# EasyEDA Pro project [EVT_Rev_A]Shock_Measurement.eprj

# Schematic Schematic1
Board Name: Board1; Create Date: 2025-05-25; Page Name: P1; Project Name: [EVT_Rev A]Shock_Measurement; Schematic Name: Schematic1; Update Date: 2025-05-26; Company: 嘉立创EDA; Page Size: A4; Version: V1.0
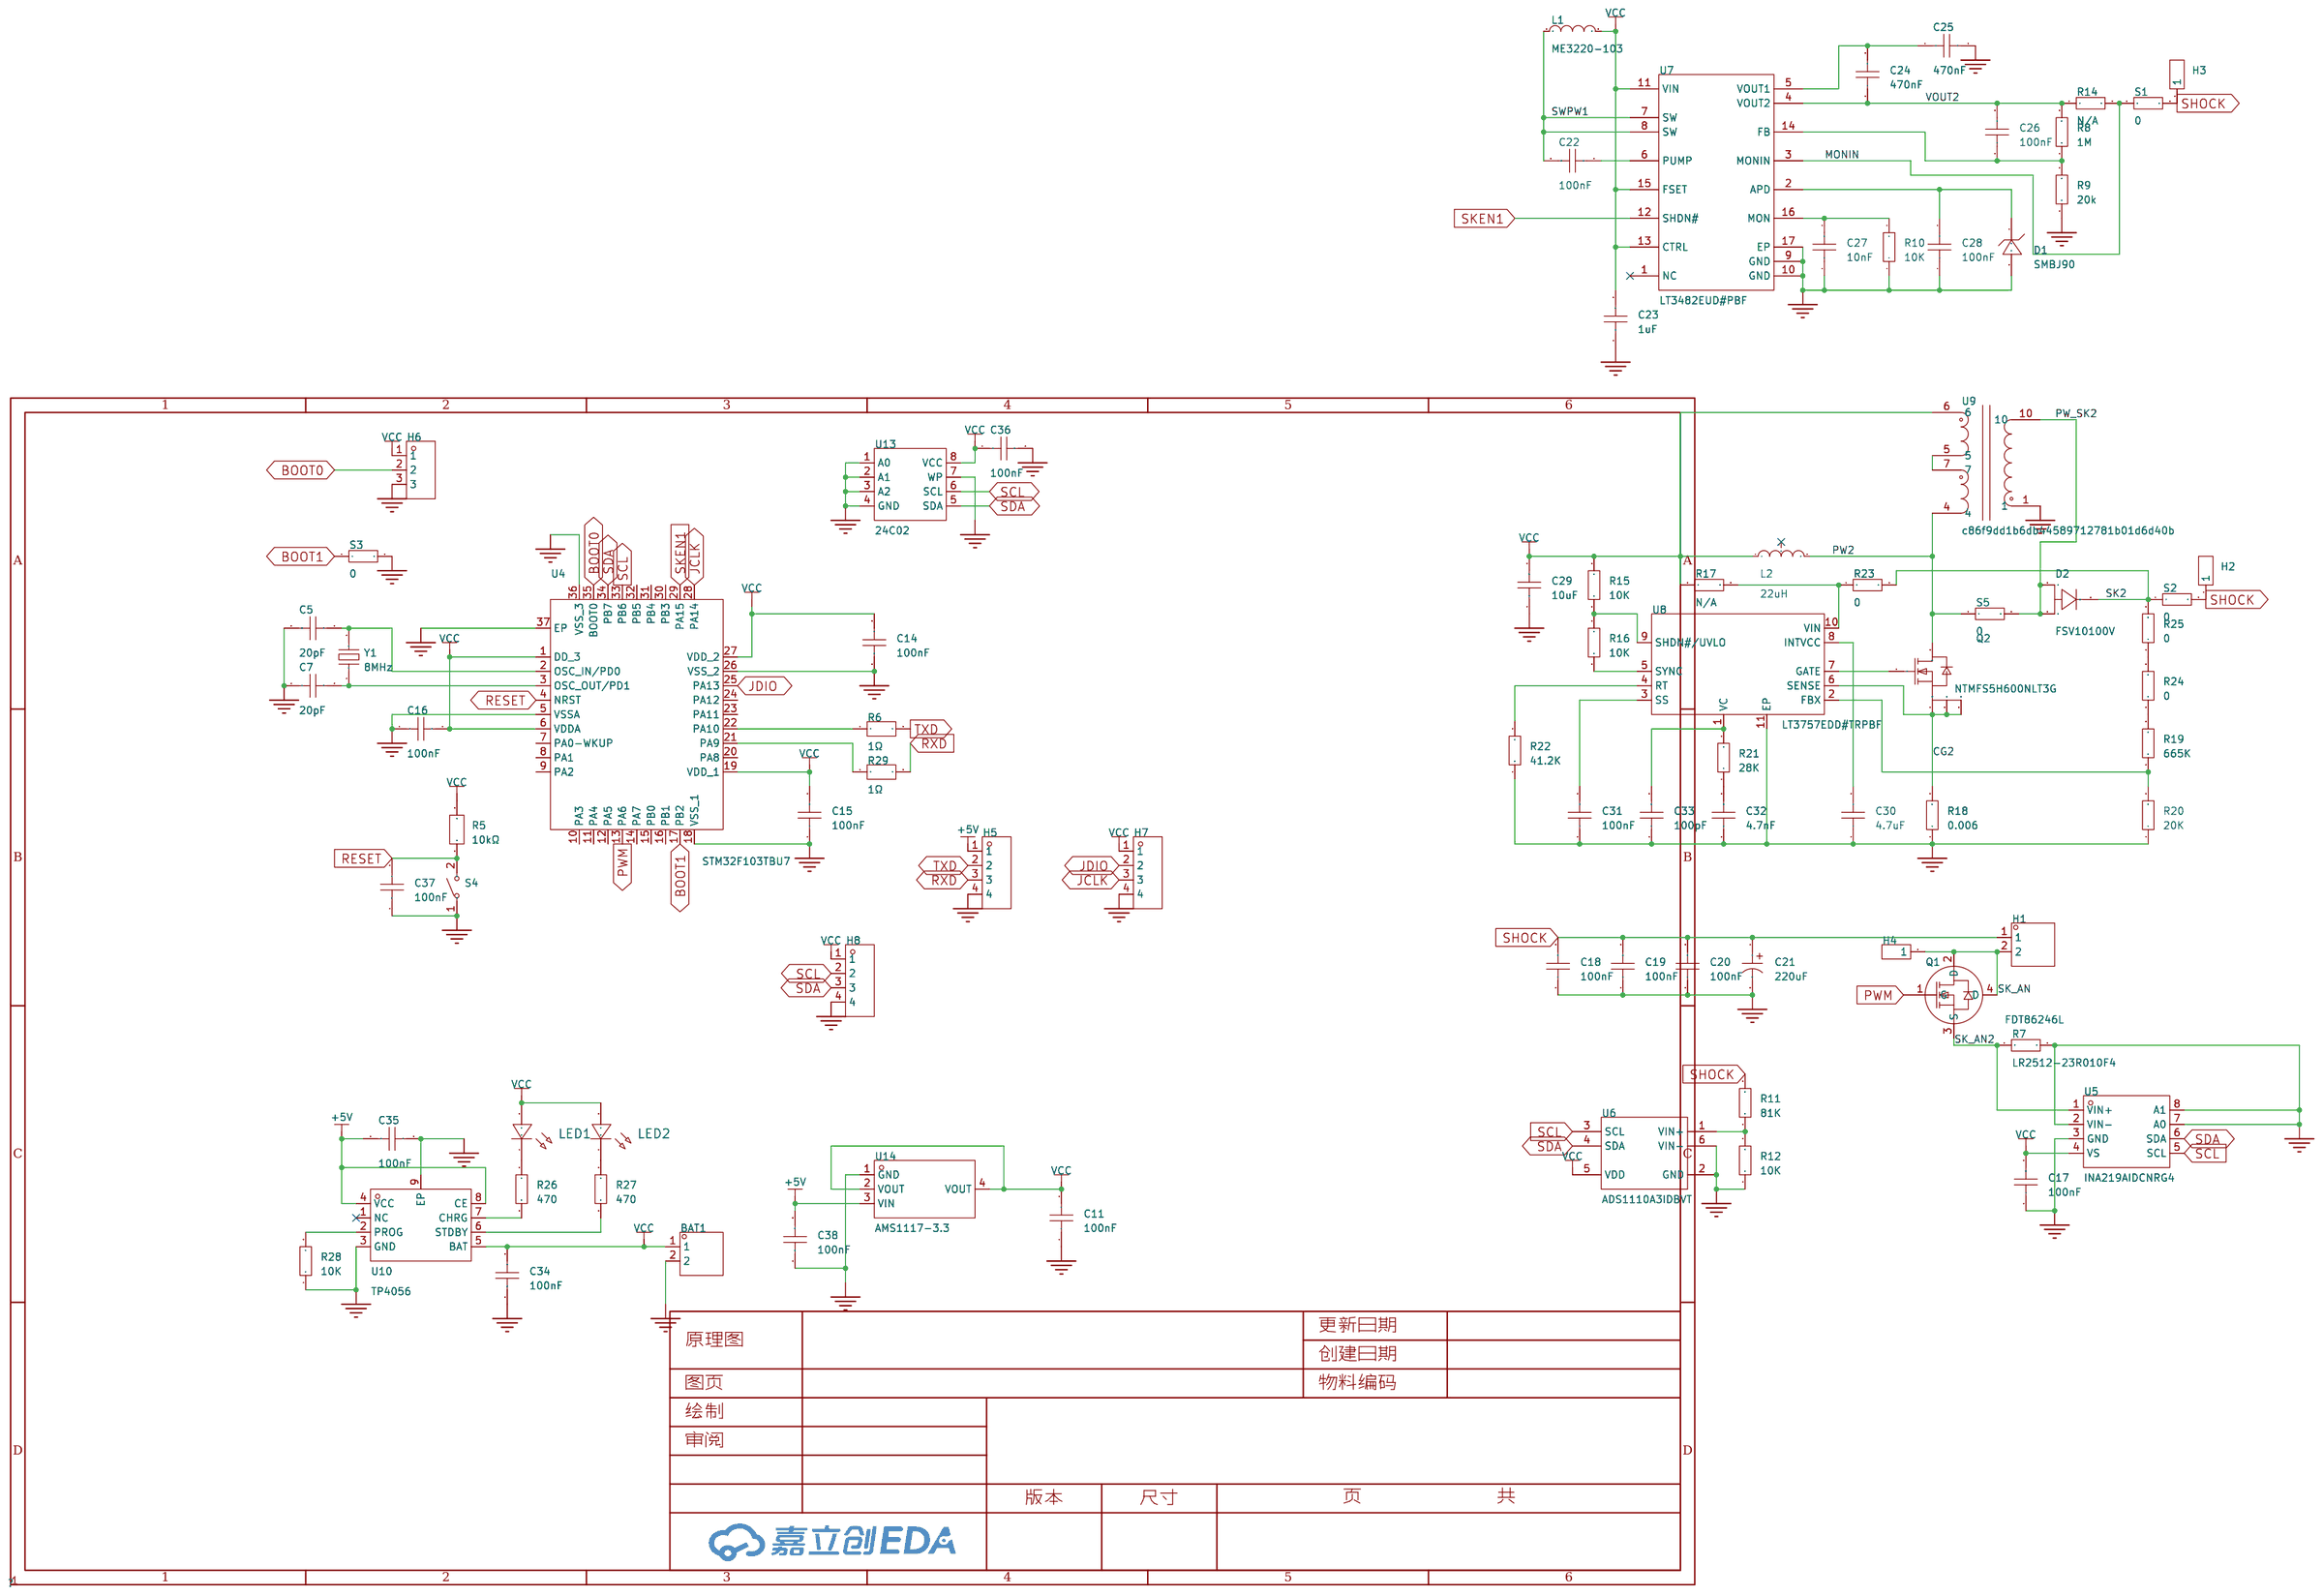
[diagram p0: schematic sheet]

## Parts
BAT1  -  [HDR-TH_2P-P2.54-V-M-1]
C5  20pF  [C0603]
C7  20pF  [C0603]
C11  100nF  [C0603]
C14  100nF  [C0603]
C15  100nF  [C0603]
C16  100nF  [C0603]
C17  100nF  [C0603]
C18  100nF  [C0603]
C19  100nF  [C0805]
C20  100nF  [C1206]
C21  220uF  [CAP-TH_BD8.0-P3.50-D0.6-FD]
C22  100nF  [C0603]
C23  1uF  [C0603]
C24  470nF  [C1206]
C25  470nF  [C1206]
C26  100nF  [C0603]
C27  10nF  [C0603]
C28  100nF  [C0603]
C29  10uF  [C1206]
C30  4.7uF  [C1206]
C31  100nF  [C0603]
C32  4.7nF  [C0603]
C33  100pF  [C0603]
C34  100nF  [C0603]
C35  100nF  [C0603]
C36  100nF  [C0603]
C37  100nF  [C0603]
C38  100nF  [C0603]
D1  SMBJ90  [SMB_L4.6-W3.6-LS5.3-RD]
D2  FSV10100V  [TO-277A_L5.9-W4.4-LS6.5-TR]
H1  -  [HDR-TH_2P-P2.54-V-M-1]
H2  -  [HDR-TH_1P-V-M_XKB_X4611WV-01I-C28D40]
H3  -  [HDR-TH_1P-V-M_XKB_X4611WV-01I-C28D40]
H4  -  [HDR-TH_1P-V-M_XKB_X4611WV-01I-C28D40]
H5  -  [HDR-TH_4P-P2.54-V-M]
H6  -  [HDR-TH_3P-P2.54-V-M]
H7  -  [HDR-TH_4P-P2.54-V-M]
H8  -  [HDR-TH_4P-P2.54-V-M]
L1  ME3220-103  [IND-SMD_L3.2-W2.8]
L2  22uH  [SMD-3_SER2915H-222KL]
LED1  -  [LED_0603]
LED2  -  [LED_0603]
Q1  FDT86246L  [SOT-223-4_L6.5-W3.5-P2.30-LS7.0-BR]
Q2  NTMFS5H600NLT3G  [DFN-5_L4.9-W5.9-P1.27-LS6.2-BL]
R5  10kΩ  [R0603]
R6  1Ω  [R0603]
R7  LR2512-23R010F4  [RES-SMD_L6.4-W3.2]
R8  1M  [R0603]
R9  20k  [R0603]
R10  10K  [R0603]
R11  81K  [R0603]
R12  10K  [R0603]
R14  N/A  [R1206]
R15  10K  [R0603]
R16  10K  [R0603]
R17  N/A  [R0603]
R18  0.006  [R1206]
R19  665K  [R0603]
R20  20K  [R0603]
R21  28K  [R0603]
R22  41.2K  [R0603]
R23  0  [R0603]
R24  0  [R0603]
R25  0  [R0603]
R26  470  [R0603]
R27  470  [R0603]
R28  10K  [R0603]
R29  1Ω  [R0603]
S1  0  [R1206]
S2  0  [R1206]
S3  0  [R0603]
S4  GT-TC024S-H0060-L1  [SW-SMD_L3.0-W2.0-LS3.5]
S5  0  [R1206]
U4  STM32F103TBU7  [UQFN-36_L6.0-W6.0-P0.50-BL-EP3.7]
U5  INA219AIDCNRG4  [SOT-23-8_L2.9-W1.6-P0.65-LS2.8-BR]
U6  ADS1110A3IDBVT  [SOT-23-6_L2.9-W1.6-P0.95-LS2.8-BR]
U7  LT3482EUD#PBF  [QFN-16_L3.0-W3.0-P0.50-BL-EP1.7]
U8  LT3757EDD#TRPBF  [DFN-10_L3.0-W3.0-P0.50-BL-EP-1]
U9  c86f9dd1b6db44589712781b01d6d40b  [DCT15EFD]
U10  TP4056  [ESOP-8_L4.9-W3.9-P1.27-LS6.0-BL-EP-1]
U13  24C02  [SOP-8_L4.9-W3.9-P1.27-LS6.0-BL]
U14  AMS1117-3.3  [SOT-223-3_L6.5-W3.4-P2.30-LS7.0-BR]
Y1  8MHz  [CRYSTAL-SMD_L5.0-W3.2]

## Library data of the parts
BAT1 H1 = HDR-M_2.54_1x2P: Supplier Part: C124375; Supplier Footprint: 插件
C5 C7 = CSA0603C0G200J500JT: 容值:20pF;精度:±5%;额定电压:50V;材质(温度系数):C0G;; LCSC Part Name: 20pF ±5% 50V; Supplier Part: C18220910; Manufacturer: HRE(芯声); Supplier Footprint: 0603; JLCPCB Part Class: 扩展库; Datasheet: https://atta.szlcsc.com/upload/public/pdf/source/20220805/DFFB7DC11B0ABF32BF494A73A541956B.pdf; Supplier: LCSC; Tolerance: ±5%; Voltage Rated: 50V; Temperature Coefficient: C0G
C11 C36 C38 = 0201X104K160NT: 容值:100nF;精度:±10%;额定电压:16V;材质(温度系数):X5R;; LCSC Part Name: 100nF ±10% 16V; Supplier Part: C2846674; Manufacturer: FH(风华); Supplier Footprint: 0201; JLCPCB Part Class: 扩展库; Datasheet: https://atta.szlcsc.com/upload/public/pdf/source/20220211/3FDF6092789FC56E23A16E03DC7301F9.pdf; Supplier: LCSC; Tolerance: ±10%; Voltage Rated: 16V; Temperature Coefficient: X5R
C14-C18 C22 C23 C26-C28 C31-C35 C37 = CAP_0603: Supplier Footprint: 0603
C19 = CAP_0805: Supplier Footprint: 0805
C20 C24 C25 C29 C30 = CAP_1206: Supplier Footprint: 1206
C21 = PA35V220M8x8: LCSC Part Name: 220uF ±20% 35V; Supplier Part: C46550431; Manufacturer: 捷而瑞; Supplier Footprint: 插件,D8xL8mm; JLCPCB Part Class: 扩展库; Datasheet: https://atta.szlcsc.com/upload/public/pdf/source/20250307/831193F737CAF6D75AC25F14E955F0EC.pdf; Supplier: LCSC; Tolerance: ±20%; Voltage Rating: 35V; Ripple Current: 2.9A@100Hz; Equivalent Series Resistance(ESR): 28mΩ@100kHz; Diameter: 8mm; Height - Seated (Max): 8mm; Lifetime: 2000hrs@105℃; Operating Temperature: -55℃~+105℃
D1 = SMBJ24CD-M3/I: Supplier Part: C335775; Manufacturer: VISHAY(威世); Supplier Footprint: SMBJ; Datasheet: https://atta.szlcsc.com/upload/public/pdf/source/20181122/C335775_149570DB14F3A9C7607A2247C4D338E7.pdf; Supplier: LCSC; polarity: 双向; Reverse Stand-Off Voltage (Vrwm): 24V; Maximum Clamping Voltage: 38.4V; Peak Pulse Current (Ipp)@10/1000us: 15.6A; Peak Pulse Power Dissipation (Ppp)@10/1000us: 600W; Breakdown Voltage: 27.1V; Type: TVS
D2 = FSV10100V: LCSC Part Name: 电压:100V 电流:10A; Supplier Part: C719813; Manufacturer: onsemi(安森美); Supplier Footprint: TO-277-3; JLCPCB Part Class: 扩展库; Datasheet: https://atta.szlcsc.com/upload/public/pdf/source/20200807/C719813_CB8FE0C48E9E111741723536464B86A6.pdf; Supplier: LCSC; Diode Configuration: 独立式; Forward Voltage (Vf@If): 625mV@10A; Reverse Voltage (Vr): 100V; Average Rectified Current (Io): 10A; Reverse Leakage Current (Ir): 16.5uA@100V
H2-H4 = HDR-M_2.54_1x1P: Supplier Part: C81276; Supplier Footprint: 插件; JLCPCB Part Class: Extended Part
H5 H7 H8 = HDR-M_2.54_1x4P: Supplier Part: C492403; Supplier Footprint: 插件
H6 = HDR-M_2.54_1x3P: Supplier Part: C2937625; Supplier Footprint: 插件
L1 = ME3220-222MLC: Supplier Part: C19276061; Manufacturer: Coilcraft(线艺); Supplier Footprint: SMD,3.2x2.8mm; JLCPCB Part Class: 扩展库; Supplier: LCSC
L2 = SER2918H-223KL: LCSC Part Name: 22uH ±10% 12A; Supplier Part: C17398237; Manufacturer: Coilcraft(线艺); Supplier Footprint: SMD-3P,27.9x19.8mm; JLCPCB Part Class: 扩展库; Datasheet: https://atta.szlcsc.com/upload/public/pdf/source/20250106/1CF0FC8358061C67E32BA823C2633CFC.pdf; Supplier: LCSC; Tolerance: ±10%; Current Rating: 20A; Current - Saturation(Isat): 12A; DC Resistance(DCR): 2.86mΩ; Ratings: AEC-Q200
LED1 LED2 = LED_0603-R: Supplier Footprint: 0603
Q1 = FDT86246L: 类型:1个N沟道;漏源电压(Vdss):150V;连续漏极电流(Id):2A;导通电阻(RDS(on)@Vgs,Id):228mΩ@10V,2A;功率(Pd):2.2W;阈值电压(Vgs(th)@Id):2.5V@250uA;; LCSC Part Name: 1个N沟道 耐压:150V 电流:2A; Supplier Part: C894836; Manufacturer: onsemi(安森美); Supplier Footprint: SOT-223; JLCPCB Part Class: 扩展库; Datasheet: https://atta.szlcsc.com/upload/public/pdf/source/20210810/FC0B0CAF79AABB1D000473A422D4F683.pdf; Supplier: LCSC; Type: 1个N沟道; Drain Source Voltage (Vdss): 150V; Continuous Drain Current (Id): 2A; Drain Source On Resistance (RDS(on)@Vgs,Id): 228mΩ@10V,2A; Power Dissipation (Pd): 2.2W; Gate Threshold Voltage (Vgs(th)@Id): 2.5V@250uA; Total Gate Charge (Qg@Vgs): 6.3nC@10V; Input Capacitance (Ciss@Vds): 335pF@75V; Reverse Transfer Capacitance (Crss@Vds): 5pF@75V; Operating Temperature: -55℃~+150℃
Q2 = NTMFS5H600NLT3G: LCSC Part Name: N沟道 耐压:60V 电流:250A; Supplier Part: C893888; Manufacturer: onsemi(安森美); Supplier Footprint: DFN-5(5.9x4.9); JLCPCB Part Class: 扩展库; Datasheet: https://atta.szlcsc.com/upload/public/pdf/source/20221020/5F8A0561D4924581173CCC558E049BA7.pdf; Supplier: LCSC; Type: N沟道; Drain Source Voltage (Vdss): 60V; Continuous Drain Current (Id): 250A; Power Dissipation (Pd): 160W; Drain Source On Resistance (RDS(on)@Vgs,Id): 1.1mΩ@10V,50A; Gate Threshold Voltage (Vgs(th)@Id): 2V@250uA; Total Gate Charge (Qg@Vgs): 40nC@4.5V; Input Capacitance (Ciss@Vds): 6.68nF@30V; Reverse Transfer Capacitance (Crss@Vds): 30pF@30V; Operating Temperature: -55℃~+150℃@(Tj)
R5 = RCA0310KJLF: 阻值:10kΩ;精度:±5%;功率:100mW;; LCSC Part Name: 10kΩ ±5% 100mW; Supplier Part: C22369937; Manufacturer: HKR(香港电阻); Supplier Footprint: 0603; JLCPCB Part Class: 扩展库; Datasheet: https://atta.szlcsc.com/upload/public/pdf/source/20240327/626E23E3B2A799D2C85303DE2C37BB2A.pdf; Supplier: LCSC; Tolerance: ±5%; Power(Watts): 100mW
R6 R29 = FRC0603J1R0 TS: 电阻类型:厚膜电阻;阻值:1Ω;精度:±5%;功率:100mW;最大工作电压:75V;温度系数:±200ppm/℃;; LCSC Part Name: 1Ω ±5% 100mW 厚膜电阻; Supplier Part: C2907116; Manufacturer: FOJAN(富捷); Supplier Footprint: 0603; JLCPCB Part Class: 扩展库; Datasheet: https://atta.szlcsc.com/upload/public/pdf/source/20211221/925EC7D7225764EE0046F22065062C87.pdf; Supplier: LCSC; Type: 厚膜电阻; Tolerance: ±5%; Power(Watts): 100mW; Overload Voltage (Max): 75V; Temperature Coefficient: ±200ppm/℃; Operating Temperature Range: -55℃~+155℃
R7 = LR2512-23R010F4: LCSC Part Name: LR2512-23R010F4 合金电阻; Supplier Part: C323803; Manufacturer: RALEC(旺诠); Supplier Footprint: 2512; Datasheet: https://atta.szlcsc.com/upload/public/pdf/source/20181106/C323808_B7090B4A64E6BD0A15998A838DE41D20.pdf; Supplier: LCSC
R8-R12 R15-R17 R19-R28 S3 = Res_0603: Supplier Footprint: 0603
R14 S1 S2 S5 = Res_1218: Supplier Footprint: 1218
R18 = Res_1206: Supplier Footprint: 1206
S4 = GT-TC024S-H0060-L1: 作用力:1.6N;机械寿命:10万次;; LCSC Part Name: 3x2x0.6轻触开关 160gf; Supplier Part: C963197; Manufacturer: G-Switch(品赞); Supplier Footprint: SMD,2x3mm; JLCPCB Part Class: 扩展库; Datasheet: https://atta.szlcsc.com/upload/public/pdf/source/20240820/65D40FDEDF69E37241261E1875AECD00.pdf; Supplier: LCSC; Operating Force: 1.6N; Mechanical Life: 10万次
U4 = STM32F103TBU7: LCSC Part Name: 主流增强型ARM Cortex-M3 MCU，具有128 KB Flash、72 MHz CPU、电机控制、USB和CAN; Supplier Part: C1339326; Manufacturer: ST(意法半导体); Supplier Footprint: UQFN-36-EP(6x6); JLCPCB Part Class: 扩展库; Datasheet: https://atta.szlcsc.com/upload/public/pdf/source/20191108/C446030_27D91C05707EDD0145409FE106B48E64.pdf; Supplier: LCSC; CPU Core: ARM-M3; CPU Maximum Speed: 72MHz; Program Storage Size: 128KB; Program Memory Type: FLASH; Number of I/O: 26; ADC (Bit): 12bit; Low Voltage Detection Threshold: 2V~3.6V
U5 = INA219AIDCNRG4: Supplier Part: C2155693; Manufacturer: TI(德州仪器); Supplier Footprint: SOT-23-8; JLCPCB Part Class: 扩展库; Supplier: LCSC
U6 = ADS1110A3IDBVT: Supplier Part: C94791; Manufacturer: TI(德州仪器); Supplier Footprint: SOT-23-6; Datasheet: https://www.ti.com/cn/lit/gpn/ads1110; Supplier: LCSC; Interface: I2C; differential input: 是; number of channels: 1; Supply Voltage: 2.7V~5.5V; Integral nonlinearity: ±0.01%; sampling frequency: 240Hz; resolution: 16; Operating Temperature: -40℃~+85℃
U7 = LT3482EUD#PBF: LCSC Part Name: 具 APD 电流监视器的 90V 升压型 DC/DC 转换器; Supplier Part: C117167; Manufacturer: ADI(亚德诺); Supplier Footprint: QFN-16-EP(3x3); JLCPCB Part Class: 扩展库; Datasheet: https://atta.szlcsc.com/upload/public/pdf/source/20170712/C117167_1499832323072814351.pdf; Supplier: LCSC; Function: 升压型; Output Type: 可调; Input Voltage: 2.5V~16V; Output Voltage: 5V~90V; Output Current: 280mA; Switching Frequency: 1.1MHz; Operating Temperature: -40℃~+85℃@(TA); Synchronous Rectification: 否; Number of Outputs: 1; Topology: 升压式; Switch tube (built-in/external): 内置
U8 = LT3757EDD#TRPBF: 功能类型:升压型;工作电压:2.9V~40V;输出电流:-;; LCSC Part Name: 升压、反激式、SEPIC 和负输出控制器; Supplier Part: C2658010; Manufacturer: ADI(亚德诺); Supplier Footprint: DFN-10-EP(3x3); JLCPCB Part Class: 扩展库; Datasheet: https://atta.szlcsc.com/upload/public/pdf/source/20170712/C117410_1499832417387814593.pdf; Supplier: LCSC; Function: 升压型; Input Voltage: 2.9V~40V; Switching Frequency: 1MHz; Operating Temperature: -40℃~+125℃@(TJ); Number of Outputs: 1; Topology: SEPIC；升压式；反激式；反相式; Switch tube (built-in/external): 外置
U9 = DCT15EFD
U10 = TP4056_C17702041: LCSC Part Name: TP4056 电池管理 停产; Supplier Part: C17702041; Manufacturer: HXY MOSFET(华轩阳电子); Supplier Footprint: ESOP-8; JLCPCB Part Class: 扩展库; Datasheet: https://atta.szlcsc.com/upload/public/pdf/source/20230912/2EE332A4C24CC2A2ED62D53FAF413673.pdf; Supplier: LCSC; Supply Voltage: 4.5V~8V; Maximum Charge Current: 1.2A; Type of Battery: 锂离子; Number of Cells: 1
U13 = 24C02: 24C02是电可擦除PROM，采用256x8-bit的组织架构，具有页写能力，每页为8字节。支持I2C总线传输协议，工作电压范围1.8V~5.5V，擦写寿命100万次，数据保持时间100年。; LCSC Part Name: 24C02串行I2C总线EEPROM 停产; Supplier Part: C2984961; Manufacturer: HX(恒佳兴); Supplier Footprint: SOP-8; Datasheet: https://atta.szlcsc.com/upload/public/pdf/source/20220328/EEDD5B560A30EF54D50A97B6296179D0.pdf; Supplier: LCSC
U14 = AMS1117-3.3_C6186: 输出类型:固定;最大输入电压:-;输出电压:3.3V;最大输出电流:1A;电源纹波抑制比(PSRR):72dB@(120Hz);输出极性:正极;; LCSC Part Name: 输出3.3V 1A; Supplier Part: C6186; Manufacturer: AMS; Supplier Footprint: SOT-223; JLCPCB Part Class: 基础库; Datasheet: https://atta.szlcsc.com/upload/public/pdf/source/20180727/C6186_7A095716F0823C02F1997A905E26C086.pdf; Supplier: LCSC; Output Type: 固定; Output Voltage: 3.3V; MAX Output Current: 1A; Power Supply Rejection Ratio (PSRR): 72dB@(120Hz); Dropout Voltage: 1.3V@(800mA); Output Polarity: 正极; Number of Outputs: 1
Y1 = S50328M20PF10PPM2P: 频率:8MHz;外接负载电容:20pF;频率稳定度(全温):±30ppm;; LCSC Part Name: 8MHz 20pF; Supplier Part: C7473032; Manufacturer: SST(索斯特); Supplier Footprint: SMD5032-2P; JLCPCB Part Class: 扩展库; Supplier: LCSC; External load capacitor: 20pF; Frequency Stability(Full temperature range): ±30ppm; Operating Temperature: -40℃~+85℃

## Nets
+5V: C35.1 C38.2 H5.1 U10.4(VCC) U10.8(CE) U14.3(VIN)
GND: BAT1.2 C5.1 C7.1 C11.1 C14.1 C15.1 C16.1 C17.1 C18.1 C19.1 C20.1 C21.2 C23.1 C25.2 C27.1 C28.1 C29.1 C30.1 C31.1 C32.1 C33.1 C34.1 C35.2 C36.2 C37.1 C38.1 D1.2(A) H5.4 H6.3 H7.4 H8.4 R7.2 R9.1 R10.1 R12.1 R18.1 R20.1 R22.1 R28.1 S3.2 S4.1 U4.5(VSSA) U4.18(VSS_1) U4.26(VSS_2) U4.36(VSS_3) U4.37(EP) U5.2(VIN-) U5.3(GND) U5.7(A0) U5.8(A1) U6.2(GND) U6.6(VIN-) U7.9(GND) U7.10(GND) U7.17(EP) U8.11(EP) U9.1 U10.3(GND) U10.9(EP) U13.1(A0) U13.2(A1) U13.3(A2) U13.4(GND) U13.7(WP) U14.1(GND)
VCC: BAT1.1 C11.2 C14.2 C15.2 C16.2 C17.2 C23.2 C29.2 C34.2 C36.1 H6.1 H7.1 H8.1 L1.2 L2.1 LED1.2(A) LED2.2(A) R5.2 R15.2 R17.1 U4.1(DD_3) U4.6(VDDA) U4.19(VDD_1) U4.27(VDD_2) U5.4(VS) U6.5(VDD) U7.11(VIN) U7.13(CTRL) U7.15(FSET) U9.6 U10.5(BAT) U13.8(VCC) U14.2(VOUT) U14.4(VOUT)
BOOT0: H6.2 U4.35(BOOT0)
BOOT1: S3.1 U4.17(PB2)
CG2: Q2.1(S) Q2.2(S) Q2.3(S) R18.2 U8.6(SENSE)
JCLK: H7.3 U4.28(PA14)
JDIO: H7.2 U4.25(PA13)
MONIN: R14.2 S1.1 U7.3(MONIN)
PW2: L2.2 Q2.5(D) S5.1 U9.4
PW_SK2: D2.1 D2.2 S5.2 U9.10
PWM: Q1.1(G) U4.13(PA6)
RESET: C37.2 R5.1 S4.2 U4.4(NRST)
RXD: H5.3 R29.2
SCL: H8.2 U4.33(PB6) U5.5(SCL) U6.3(SCL) U13.6(SCL)
SDA: H8.3 U4.34(PB7) U5.6(SDA) U6.4(SDA) U13.5(SDA)
SHOCK: C18.2 C19.2 C20.2 C21.1 H1.1 H2.1 H3.1 R11.2 S1.2 S2.2
SK2: D2.3 R23.2 R25.2 S2.1
SK_AN: H1.2 H4.1 Q1.2(D) Q1.4(D)
SK_AN2: Q1.3(S) R7.1 U5.1(VIN+)
SKEN1: U4.29(PA15) U7.12(SHDN#)
SWPW1: C22.2 L1.1 U7.7(SW) U7.8(SW)
TXD: H5.2 R6.2
VOUT2: C24.1 C26.2 R8.2 R14.1 U7.4(VOUT2)
$1N2976: C5.2 U4.2(OSC_IN/PD0) Y1.2
$1N2977: C7.2 U4.3(OSC_OUT/PD1) Y1.1
$1N6546: C22.1 U7.6(PUMP)
$1N6755: C24.2 C25.1 U7.5(VOUT1)
$1N6889: C26.1 R8.1 R9.2 U7.14(FB)
$1N7063: C27.2 R10.2 U7.16(MON)
$1N7288: C28.2 D1.1(K) U7.2(APD)
$1N7411: R11.1 R12.2 U6.1(VIN+)
$1N8900: R15.1 R16.2 U8.9(SHDN#/UVLO)
$1N8946: R16.1 U8.5(SYNC)
$1N9017: R17.2 R23.1 U8.10(VIN)
$1N9213: Q2.4(G) U8.7(GATE)
$1N9419: R19.1 R20.2 U8.2(FBX)
$1N9497: C30.2 U8.8(INTVCC)
$1N9569: C31.2 U8.3(SS)
$1N9658: C33.2 R21.2 U8.1(VC)
$1N9684: C32.2 R21.1
$1N9747: R22.2 U8.4(RT)
$1N9911: U9.5 U9.7
$1N10070: R19.2 R24.1
$1N10096: R24.2 R25.1
$1N11853: LED1.1(C) R26.2
$1N11879: LED2.1(C) R27.2
$1N11907: R26.1 U10.7(CHRG)
$1N11914: R27.1 U10.6(STDBY)
$1N11976: R28.2 U10.2(PROG)
$1N12461: R29.1 U4.21(PA9)
$1N12467: R6.1 U4.22(PA10)

Not connected (* = marked no-connect by the designer): L2 3*; U4 7(PA0-WKUP) 8(PA1) 9(PA2) 10(PA3) 11(PA4) 12(PA5) 14(PA7) 15(PB0) 16(PB1) 20(PA8) 23(PA11) 24(PA12) 30(PB3) 31(PB4) 32(PB5); U7 1(NC)*; U10 1(NC)*

# Board PCB1
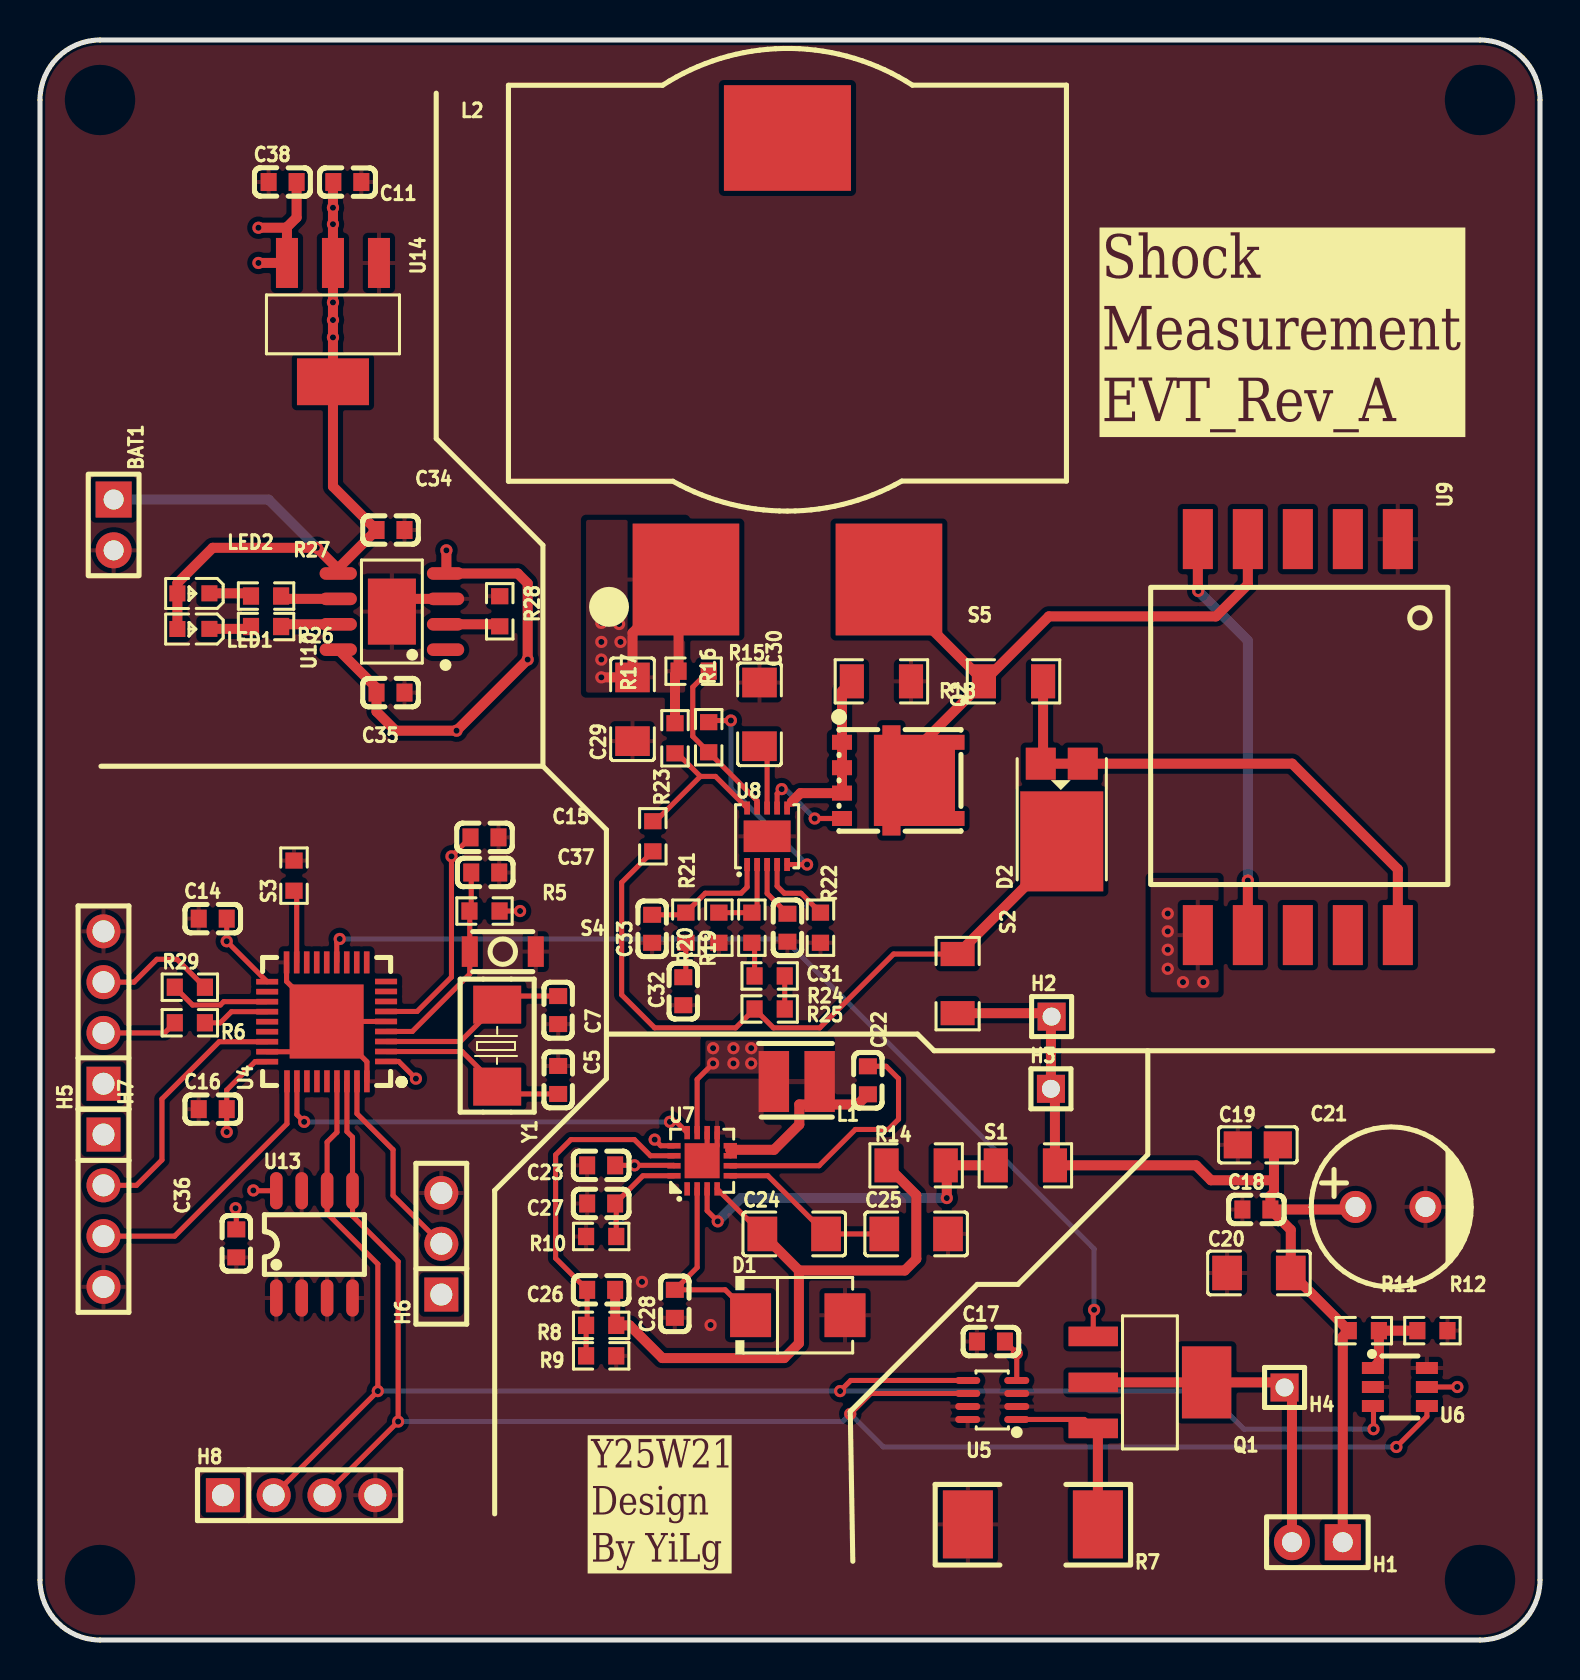
[diagram p1: board, top side]
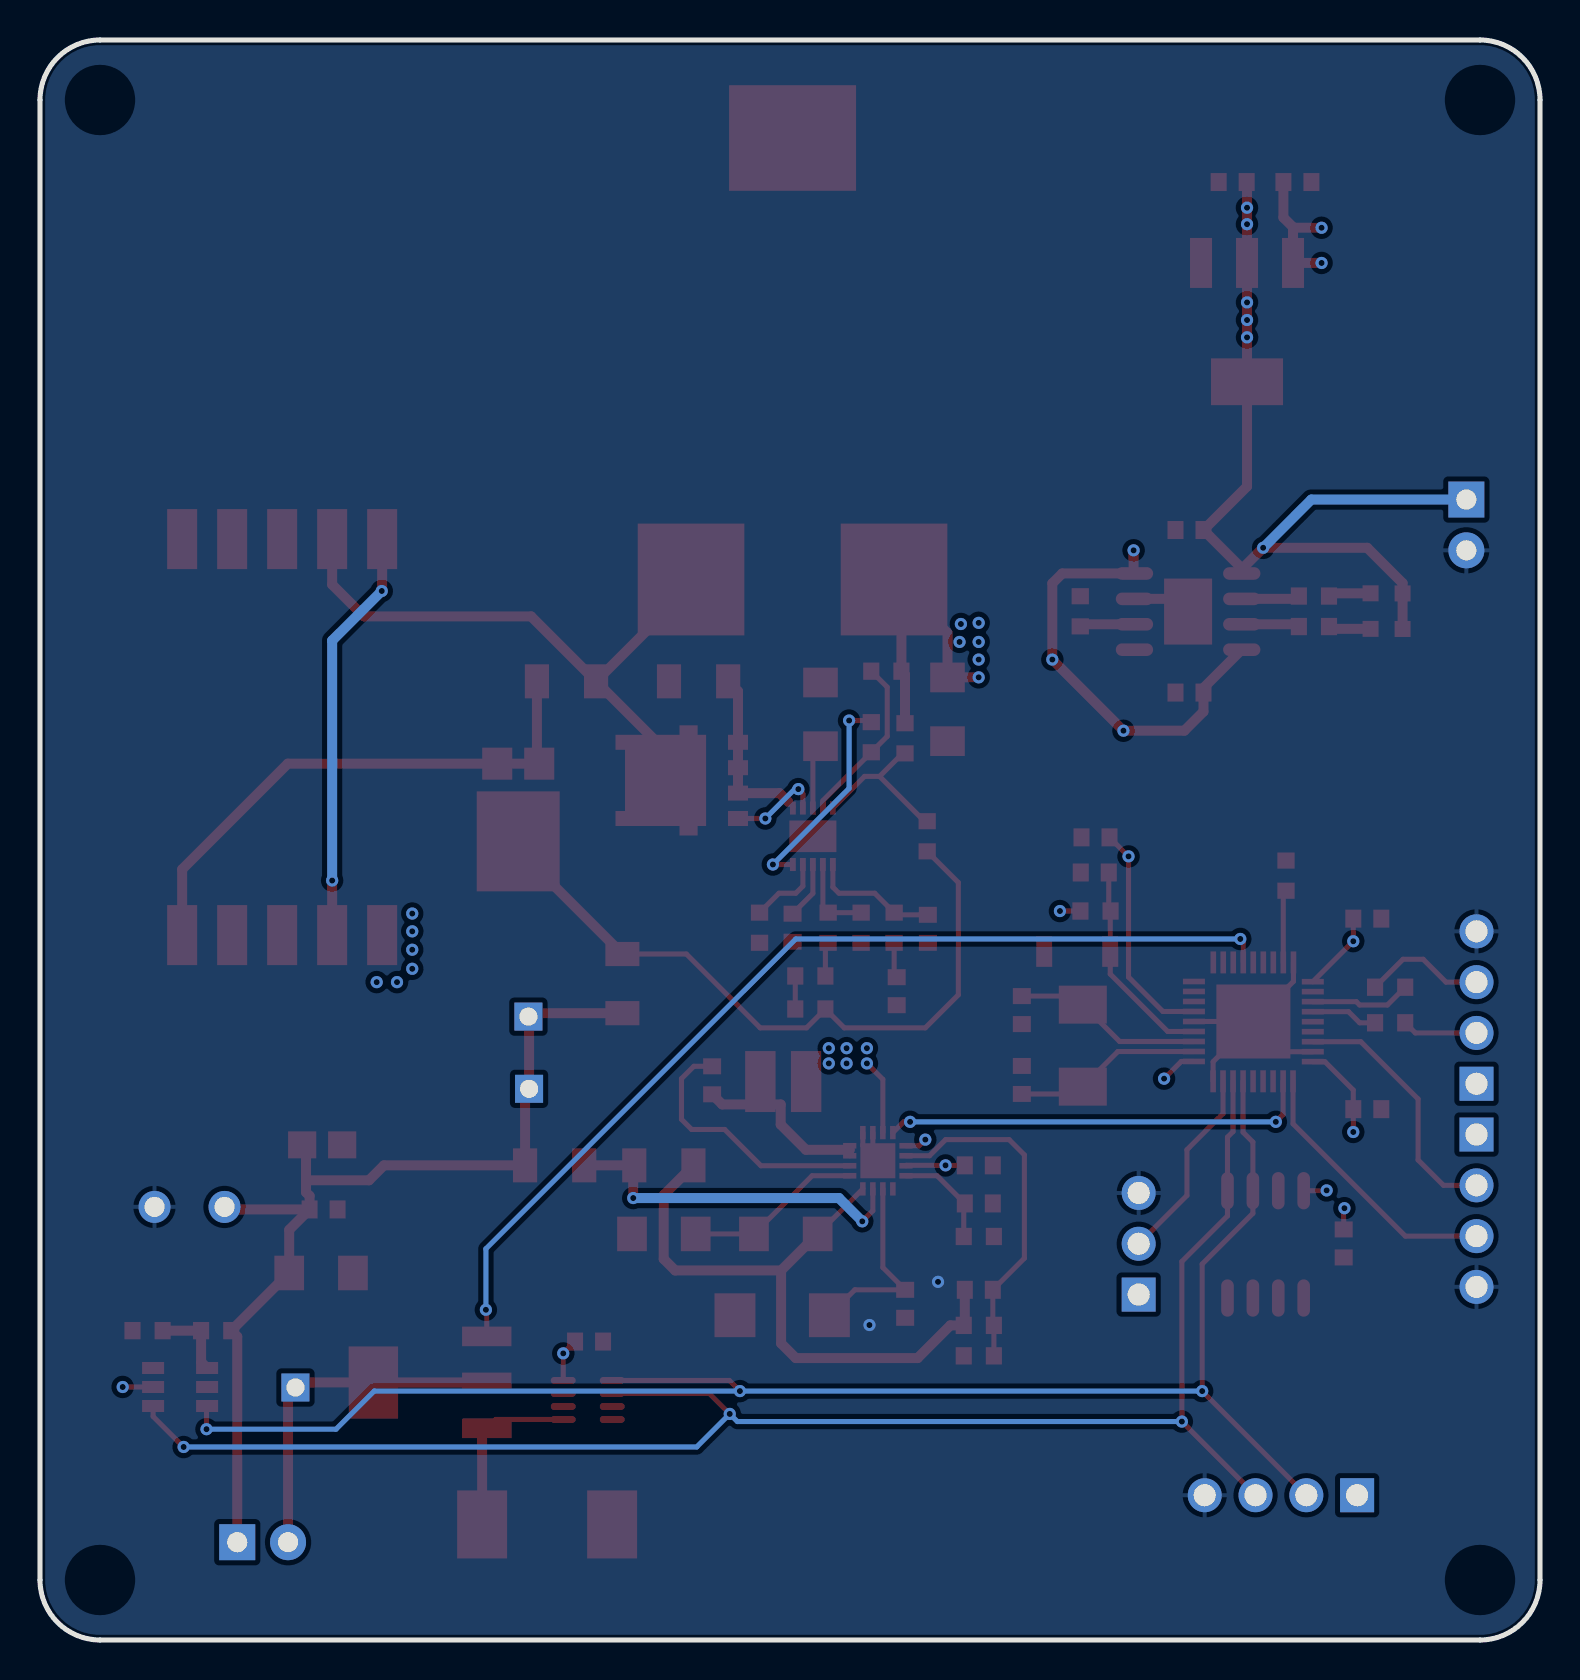
[diagram p2: board, bottom side, seen from below]

Outline 75 x 80 mm; copper layers: Top Layer, Inner1, Inner2, Bottom Layer. Coordinates in mm from the lower left corner of the outline.
Outline path: 0,77 arc(0.88,79.12) 3,80 72,80 arc(74.12,79.12) 75,77 75,3 arc(74.12,0.88) 72,0 3,0 arc(0.88,0.88) 0,3 0,77
Stack: Top Layer 0.035mm 外层铜厚1oz / Dielectric1 0.2104mm 7628 RC49% 8.6mil / Inner1 0.0152mm 内层铜厚 / Dielectric2 1.065mm 1.1mm H/HOZ Copper / Inner2 0.0152mm 内层铜厚 / Dielectric3 0.2104mm 7628 RC49% 8.6mil / Bottom Layer 0.035mm 外层铜厚1oz

## Design rules (mm)
template: 自定义配置
spacing copperThickness1oz (default): track to track 0.102, other pairs 0.152 to 0.3
spacing copperThickness2oz: track to track 0.203, other pairs 0.152 to 0.3
track width copperThickness1oz (default): min 0.127, default 0.254, max 2.54
track width copperThickness2oz: min 0.203, default 0.254, max 2.54
differential pair differentialPair (default): width min 0.127, default 0.254, max 2.54; gap min 0.152, default 0.152
via viaSize (default): diameter min 0.5, default 0.61, max 10; hole min 0.3, default 0.305, max 6.3
net VCC uses copperRegion_power
pour e1420 uses copperRegion_power

## Placement (name value [footprint] x y rotation side)
BAT1  -  [HDR-TH_2P-P2.54-V-M-1]  3.68 55.75 270 top
C5  20pF  [C0603]  25.91 28 270 top
C7  20pF  [C0603]  25.91 31.5 90 top
C11  100nF  [C0603]  15.37 72.9 180 top
C14  100nF  [C0603]  8.64 36.07 0 top
C15  100nF  [C0603]  22.22 40.13 180 top
C16  100nF  [C0603]  8.64 26.54 0 top
C17  100nF  [C0603]  47.55 14.92 0 top
C18  100nF  [C0603]  60.82 21.53 0 top
C19  100nF  [C0805]  60.89 24.76 0 top
C20  100nF  [C1206]  60.95 18.35 0 top
C21  220uF  [CAP-TH_BD8.0-P3.50-D0.6-FD]  67.52 21.65 0 top
C22  100nF  [C0603]  41.39 27.98 270 top
C23  1uF  [C0603]  28.06 23.73 0 top
C24  470nF  [C1206]  37.71 20.3 0 top
C25  470nF  [C1206]  43.81 20.3 0 top
C26  100nF  [C0603]  28.06 17.51 0 top
C27  10nF  [C0603]  28.06 21.83 0 top
C28  100nF  [C0603]  31.74 16.81 90 top
C29  10uF  [C1206]  29.62 46.54 90 top
C30  4.7uF  [C1206]  35.97 46.28 270 top
C31  100nF  [C0603]  37.37 35.61 90 top
C32  4.7nF  [C0603]  32.16 32.44 90 top
C33  100pF  [C0603]  30.61 35.56 90 top
C34  100nF  [C0603]  17.53 55.5 180 top
C35  100nF  [C0603]  17.53 47.37 0 top
C36  100nF  [C0603]  9.81 19.83 270 top
C37  100nF  [C0603]  22.26 38.38 180 top
C38  100nF  [C0603]  12.13 72.9 0 top
D1  SMBJ90  [SMB_L4.6-W3.6-LS5.3-RD]  37.89 16.24 0 top
D2  FSV10100V  [TO-277A_L5.9-W4.4-LS6.5-TR]  51.09 41.87 90 top
H1  -  [HDR-TH_2P-P2.54-V-M-1]  63.87 4.89 180 top
H2  -  [HDR-TH_1P-V-M_XKB_X4611WV-01I-C28D40]  50.58 31.17 0 top
H3  -  [HDR-TH_1P-V-M_XKB_X4611WV-01I-C28D40]  50.55 27.56 0 top
H4  -  [HDR-TH_1P-V-M_XKB_X4611WV-01I-C28D40]  62.23 12.63 180 top
H5  -  [HDR-TH_4P-P2.54-V-M]  3.17 31.62 90 top
H6  -  [HDR-TH_3P-P2.54-V-M]  20.07 19.81 90 top
H7  -  [HDR-TH_4P-P2.54-V-M]  3.17 21.46 270 top
H8  -  [HDR-TH_4P-P2.54-V-M]  12.95 7.24 0 top
L1  ME3220-103  [IND-SMD_L3.2-W2.8]  37.84 27.92 180 top
L2  22uH  [SMD-3_SER2915H-222KL]  37.37 64.06 0 top
LED1  -  [LED_0603]  7.62 50.55 180 top
LED2  -  [LED_0603]  7.62 52.32 180 top
Q1  FDT86246L  [SOT-223-4_L6.5-W3.5-P2.30-LS7.0-BR]  55.5 12.88 180 top
Q2  NTMFS5H600NLT3G  [DFN-5_L4.9-W5.9-P1.27-LS6.2-BL]  41.91 42.98 270 top
R5  10kΩ  [R0603]  22.22 36.45 0 top
R6  1Ω  [R0603]  7.49 30.86 180 top
R7  LR2512-23R010F4  [RES-SMD_L6.4-W3.2]  49.64 5.78 180 top
R8  1M  [R0603]  28.06 15.73 0 top
R9  20k  [R0603]  28.06 14.21 180 top
R10  10K  [R0603]  28.06 20.18 0 top
R11  81K  [R0603]  66.19 15.47 180 top
R12  10K  [R0603]  69.62 15.47 180 top
R14  N/A  [R1206]  43.81 23.73 0 top
R15  10K  [R0603]  32.68 48.44 180 top
R16  10K  [R0603]  33.44 45.14 270 top
R17  N/A  [R0603]  31.75 45.08 270 top
R18  0.006  [R1206]  42.07 47.93 180 top
R19  665K  [R0603]  35.59 35.61 270 top
R20  20K  [R0603]  33.94 35.61 90 top
R21  28K  [R0603]  32.29 35.61 90 top
R22  41.2K  [R0603]  39.02 35.61 90 top
R23  0  [R0603]  30.64 40.19 270 top
R24  0  [R0603]  36.48 33.2 0 top
R25  0  [R0603]  36.48 31.55 180 top
R26  470  [R0603]  11.3 50.67 180 top
R27  470  [R0603]  11.3 52.2 180 top
R28  10K  [R0603]  22.99 51.44 270 top
R29  1Ω  [R0603]  7.49 32.64 0 top
S1  0  [R1206]  49.27 23.73 0 top
S2  0  [R1206]  45.88 32.82 270 top
S3  0  [R0603]  12.7 38.22 90 top
S4  GT-TC024S-H0060-L1  [SW-SMD_L3.0-W2.0-LS3.5]  23.14 34.42 180 top
S5  0  [R1206]  48.68 47.93 0 top
U4  STM32F103TBU7  [UQFN-36_L6.0-W6.0-P0.50-BL-EP3.7]  14.33 30.91 90 top
U5  INA219AIDCNRG4  [SOT-23-8_L2.9-W1.6-P0.65-LS2.8-BR]  47.61 12 0 top
U6  ADS1110A3IDBVT  [SOT-23-6_L2.9-W1.6-P0.95-LS2.8-BR]  68 12.65 180 top
U7  LT3482EUD#PBF  [QFN-16_L3.0-W3.0-P0.50-BL-EP1.7]  33.11 23.96 0 top
U8  LT3757EDD#TRPBF  [DFN-10_L3.0-W3.0-P0.50-BL-EP-1]  36.36 40.19 0 top
U9  c86f9dd1b6db44589712781b01d6d40b  [DCT15EFD]  70.39 55.05 270 top
U10  TP4056  [ESOP-8_L4.9-W3.9-P1.27-LS6.0-BL-EP-1]  17.59 51.42 90 top
U13  24C02  [SOP-8_L4.9-W3.9-P1.27-LS6.0-BL]  13.72 19.78 0 top
U14  AMS1117-3.3  [SOT-223-3_L6.5-W3.4-P2.30-LS7.0-BR]  14.65 65.88 90 top
Y1  8MHz  [CRYSTAL-SMD_L5.0-W3.2]  22.86 29.72 270 top

## Footprints (pads in the part's own frame, mm; a bottom-side part is the same pattern mirrored in y, then rotated)
C0603
  rect 0.8x0.9 smd: 1(-0.7,0) 2(0.7,0)
C0805
  rect 1.41x1.35 smd: 1(-1,0) 2(1,0)
C1206
  rect 1.485x1.728 smd: 1(-1.593,0) 2(1.593,0)
CAP-TH_BD8.0-P3.50-D0.6-FD
  round 1.6 hole 1: 1(-1.75,0) 2(1.75,0)
CRYSTAL-SMD_L5.0-W3.2
  rect 1.9x2.4 smd: 1(-2.05,0) 2(2.05,0)
DCT15EFD
  rect 3x1.5 smd: 1(0,-2.5) 2(0,-5) 3(0,-7.5) 4(0,-10) 5(0,-12.5) 6(19.8,-12.5) 7(19.8,-10) 8(19.8,-7.5) 9(19.8,-5) 10(19.8,-2.5)
DFN-5_L4.9-W5.9-P1.27-LS6.2-BL
  rect 0.75x1 smd: 1(-1.905,-1.811) 2(-0.635,-1.811) 3(0.635,-1.811) 4(1.905,-1.811)
  custom 5.51x4.53 smd: 5(0,1.811)
DFN-10_L3.0-W3.0-P0.50-BL-EP-1
  rect 0.29x0.65 smd: 1(-1,-1.411) 2(-0.5,-1.411) 3(0,-1.411) 4(0.5,-1.411) 5(1,-1.411) 6(1,1.411) 7(0.5,1.411) 8(0,1.411) 9(-0.5,1.411) 10(-1,1.411)
  rect 2.35x1.58 smd: 11(0,0)
ESOP-8_L4.9-W3.9-P1.27-LS6.0-BL-EP-1
  oval 0.63x1.865 smd: 1(-1.905,-2.683) 2(-0.635,-2.683) 3(0.635,-2.683) 4(1.905,-2.683) 5(1.905,2.683) 6(0.635,2.683) 7(-0.635,2.683) 8(-1.905,2.683)
  rect 3.3x2.4 smd: 9(0,0)
HDR-TH_1P-V-M_XKB_X4611WV-01I-C28D40
  rect 1.4x1.4 hole 0.9: 1(0,0)
HDR-TH_2P-P2.54-V-M-1
  rect 1.8x1.8 hole 1: 1(-1.27,0)
  round 1.8 hole 1: 2(1.27,0)
HDR-TH_3P-P2.54-V-M
  rect 1.7x1.7 hole 1.1: 1(-2.54,0)
  round 1.7 hole 1.1: 2(0,0) 3(2.54,0)
HDR-TH_4P-P2.54-V-M
  rect 1.7x1.7 hole 1.1: 1(-3.81,0)
  round 1.7 hole 1.1: 2(-1.27,0) 3(1.27,0) 4(3.81,0)
IND-SMD_L3.2-W2.8
  rect 1.52x3.05 smd: 1(-1.145,0) 2(1.145,0)
LED_0603
  rect 0.8x0.8 smd: 1(-0.851,-0.01) 2(0.75,-0.005)
QFN-16_L3.0-W3.0-P0.50-BL-EP1.7
  rect 0.28x0.665 smd: 1(-0.75,-1.407) 2(-0.25,-1.407) 3(0.25,-1.407) 4(0.75,-1.407) 9(0.75,1.407) 10(0.25,1.407) 11(-0.25,1.407) 12(-0.75,1.407)
  rect 0.665x0.28 smd: 5(1.407,-0.75) 6(1.407,-0.25) 7(1.407,0.25) 8(1.407,0.75) 13(-1.407,0.75) 14(-1.407,0.25) 15(-1.407,-0.25) 16(-1.407,-0.75)
  rect 1.75x1.75 smd: 17(0,0)
R0603
  rect 0.806x0.864 smd: 1(-0.753,0) 2(0.753,0)
R1206
  rect 1.208x1.701 smd: 1(-1.479,0) 2(1.479,0)
RES-SMD_L6.4-W3.2
  rect 2.5x3.4 smd: 1(-3.25,0) 2(3.25,0)
SMB_L4.6-W3.6-LS5.3-RD
  rect 2.047x2.192 smd: 1(-2.361,0) 2(2.361,0)
SMD-3_SER2915H-222KL
  rect 5.33x5.59 smd: 1(-5.075,-11.037) 2(5.075,-11.037)
  rect 6.35x5.28 smd: 3(0,11.037)
SOP-8_L4.9-W3.9-P1.27-LS6.0-BL
  oval 0.63x1.865 smd: 1(-1.905,-2.683) 2(-0.635,-2.683) 3(0.635,-2.683) 4(1.905,-2.683) 5(1.905,2.683) 6(0.635,2.683) 7(-0.635,2.683) 8(-1.905,2.683)
SOT-23-6_L2.9-W1.6-P0.95-LS2.8-BR
  rect 1.1x0.6 smd: 1(1.35,-0.95) 2(1.35,0) 3(1.35,0.95) 4(-1.35,0.95) 5(-1.35,0) 6(-1.35,-0.95)
SOT-23-8_L2.9-W1.6-P0.65-LS2.8-BR
  oval 1.252x0.35 smd: 1(1.226,-0.975) 2(1.226,-0.325) 3(1.226,0.325) 4(1.226,0.975) 5(-1.226,0.975) 6(-1.226,0.325) 7(-1.226,-0.325) 8(-1.226,-0.975)
SOT-223-3_L6.5-W3.4-P2.30-LS7.0-BR
  rect 2.5x1.1 smd: 1(2.97,-2.3) 2(2.97,0) 3(2.97,2.3)
  rect 2.34x3.6 smd: 4(-2.97,0)
SOT-223-4_L6.5-W3.5-P2.30-LS7.0-BR
  rect 2.47x0.98 smd: 1(2.835,-2.3) 2(2.835,0) 3(2.835,2.3)
  rect 2.47x3.6 smd: 4(-2.835,0)
SW-SMD_L3.0-W2.0-LS3.5
  rect 0.8x1.524 smd: 1(-1.651,0) 2(1.651,0)
TO-277A_L5.9-W4.4-LS6.5-TR
  rect 1.6x1.5 smd: 1(1.942,-1.05) 2(1.942,1.05)
  rect 5x4.15 smd: 3(-1.942,0)
UQFN-36_L6.0-W6.0-P0.50-BL-EP3.7
  rect 0.28x1.1 smd: 1(-1.981,-2.972) 2(-1.484,-2.972) 3(-0.983,-2.972) 4(-0.482,-2.972) 5(0.018,-2.972) 6(0.518,-2.972) 7(1.018,-2.972) 8(1.519,-2.972) 9(2.017,-2.972) 19(2.006,2.972) 20(1.508,2.972) 21(1.008,2.972) 22(0.508,2.972) 23(0.007,2.972) 24(-0.493,2.972) 25(-0.993,2.972) 26(-1.494,2.972) 27(-1.992,2.972)
  rect 1.1x0.28 smd: 10(2.972,-2.005) 11(2.972,-1.506) 12(2.972,-1.006) 13(2.972,-0.506) 14(2.972,-0.005) 15(2.972,0.495) 16(2.972,0.995) 17(2.972,1.496) 18(2.972,2.003) 28(-2.972,1.983) 29(-2.972,1.486) 30(-2.972,0.985) 31(-2.972,0.484) 32(-2.972,-0.015) 33(-2.972,-0.516) 34(-2.972,-1.016) 35(-2.972,-1.517) 36(-2.972,-2.014)
  rect 3.7x3.7 smd: 37(0.018,0)

## Nets
As in the schematic.

Pads without a net: L2 3; U4 7 8 9 10 11 12 14 15 16 20 23 24 30 31 32; U7 1; U9 2 3 8 9; U10 1

## Via types
v1: diameter 0.61, hole 0.305, Top Layer to Bottom Layer, 60 vias

## Routing (per net, layer and track width the routed paths; a pad name or vN(x,y) marks a point on that pad's centre or on a via; arc(x,y) is an arc through that point)
+5V: length 29.7
  Top Layer w0.5: U10.8 16.83,47.6 C35.1 16.83,46.42 17.78,45.47 v1(20.83,45.47) v1(24.38,49.02) 24.38,52.83 23.89,53.33 U10.4 20.32,53.37 v1(20.32,54.48) ; v1(10.92,68.85) U14.3 12.35,70.64 ; v1(10.92,70.61) 12.32,70.61 12.35,70.64 ; 12.35,70.64 12.83,71.12 C38.2
GND: length 20
  Top Layer w0.254: U4.37 16.35,28.91 U4.36 ; U4.37 17.3,30.93 ; U4.37 12.82,29.41 U4.26 ; U4.37 12.33,32.93 U4.18 ; U7.10 33.36,24.21 ; 33.36,24.21 33.86,24.71 U7.9 ; 33.36,24.21 U7.17
  Top Layer w0.5: U10.3 18.23,52.06 U10.9
  vias: v1(30.1,17.91) v1(33.53,15.75)
VCC: length 95.1
  Top Layer w0.254: 17.3,31.43 18.85,31.43 20.57,33.15 v1(20.57,39.18) C15.2 ; 17.3,28.93 17.94,28.93 v1(18.8,28.07) ; U5.4 v1(48.84,14.33) C17.2 ; v1(10.67,22.48) 10.68,22.46 U13.8 ; v1(9.78,21.59) 9.81,21.55 C36.1 ; R5.2 v1(24,36.45) ; v1(9.34,25.4) C16.2 9.34,27.5 10.76,28.92 U4.27 ; C23.2 v1(29.72,23.73) 31.68,23.73 U7.15 ; v1(30.73,25.02) 31.04,24.71 U7.13 ; U6.5 v1(70.87,12.65) ; U7.11 32.86,28.03 v1(33.66,28.83) ; C14.2 v1(9.34,34.94) U4.19
  Top Layer w0.5: 31.93,52.66 32.3,53.02 ; 31.93,52.66 R15.2 31.75,48.26 R17.1 ; 31.93,52.66 29.62,50.35 C29.2 29.62,48.13 v1(28.07,48.13) ; 14.91,53.54 v1(13.84,54.61) 8.64,54.61 6.87,52.84 LED2.2 LED1.2 ; 14.91,53.54 14.91,53.59 C34.2 14.65,57.68 U14.4 v1(14.65,65.13) v1(14.65,66) v1(14.65,66.88) U14.2 v1(14.65,70.79) v1(14.65,71.61) 14.65,72.88 C11.2 ; 14.91,53.54 U10.5
  Bottom Layer w0.5: BAT1.1 11.43,57.02 v1(13.84,54.61)
  vias: v1(28.07,50.86) v1(28.07,49.9) v1(28.07,49.02) v1(28.96,50.8) v1(29.02,49.9) v1(33.66,29.59) v1(34.67,29.59) v1(34.67,28.83) v1(35.56,29.59) v1(35.56,28.83) v1(56.39,36.32) v1(56.39,35.43) v1(56.39,34.51) v1(56.39,33.56) v1(57.15,32.89) v1(58.17,32.89)
BOOT0: length 9.9
  Top Layer w0.254: U4.35 15.85,26.32 17.65,24.51 17.65,22.22 H6.2
BOOT1: length 3.6
  Top Layer w0.254: S3.1 12.84,37.33 U4.17
CG2: length 8.9
  Top Layer w0.254: U8.6 37.36,41.67 37.59,41.91
  Top Layer w0.5: 37.59,41.91 38.03,42.34 Q2.3 Q2.2 Q2.1 40.1,47.44 R18.2
JCLK: length 13.6
  Top Layer w0.254: 3.17,20.19 6.73,20.19 12.35,25.81 U4.28
JDIO: length 12.9
  Top Layer w0.254: U4.25 8.96,29.92 6.1,27.05 6.1,24 4.83,22.73 H7.2
MONIN: length 17.9
  Top Layer w0.254: U7.3 33.36,21.46 v1(33.89,20.93)
  Top Layer w0.5: S1.1 R14.2 45.34,23.68 v1(45.34,22.1)
  Bottom Layer w0.5: v1(45.34,22.1) 35.05,22.1 v1(33.89,20.93)
PW2: length 30.9
  Top Layer w0.5: S5.1 43.72,44.46 Q2.5 ; S5.1 42.45,52.68 42.45,53.02 ; S5.1 50.44,51.18 58.8,51.18 60.39,52.77 U9.4
PW_SK2: length 27.5
  Top Layer w0.5: U9.10 67.89,38.53 62.61,43.82 50.04,43.82 50.15,43.93 S5.2
PWM: length 49.8
  Top Layer w0.254: v1(52.71,16.51) 52.66,16.47 Q1.1 ; v1(14.99,35.05) 14.84,34.9 U4.13
  Bottom Layer w0.254: v1(14.99,35.05) 37.21,35.05 52.71,19.56 v1(52.71,16.51)
RESET: length 10.5
  Top Layer w0.254: C37.2 21.56,36.54 R5.1 21.49,36.43 S4.2 21.49,33.3 18.61,30.43 17.3,30.43
RXD: length 6.1
  Top Layer w0.254: H5.3 4.7,32.89 5.84,34.04 6.85,34.04 R29.2
SCL: length 82.5
  Top Layer w0.254: v1(66.68,10.54) 66.68,11.67 U6.3 ; v1(40,12.45) 40.54,12.98 U5.5 ; H8.2 v1(16.89,12.45) 16.89,18.8 14.36,21.33 U13.6 14.36,24.9 14.85,25.39 U4.33
  Bottom Layer w0.254: v1(66.68,10.54) 60.2,10.54 58.29,12.45 v1(40,12.45) v1(16.89,12.45)
SDA: length 83
  Top Layer w0.254: v1(67.82,9.65) 69.34,11.18 U6.4 ; H8.3 v1(17.91,10.92) 17.91,18.92 15.63,21.2 U13.5 15.63,25.14 15.35,25.42 U4.34 ; U5.6 41.54,12.33 v1(40.51,11.3)
  Bottom Layer w0.254: v1(17.91,10.92) 40.13,10.92 v1(40.51,11.3) 42.16,9.65 v1(67.82,9.65)
SHOCK: length 49.6
  Top Layer w0.5: S2.2 50.41,31.34 H2.1 50.55,31.14 H3.1 50.75,27.36 50.75,23.73 57.8,23.73 58.55,22.99 61.7,22.99 ; C18.2 61.52,22.2 61.7,22.38 61.7,22.99 ; C18.2 62.54,20.51 C20.2 62.55,18.35 R11.2 65.14,15.17 H1.1 ; C18.2 65.65,21.53 C21.1 ; 61.7,22.99 61.7,24.56 C19.2
SK2: length 35.4
  Top Layer w0.254: S2.1 42.68,34.3 38.99,30.61 36.67,30.61 R25.2 34.79,30.61 30.73,30.61 29.08,32.26 29.08,37.87 R23.2
  Top Layer w0.5: D2.3 51.09,39.51 S2.1
SK_AN: length 17.6
  Top Layer w0.5: Q1.2 Q1.4 61.97,12.88 H4.1 62.6,12.26 H1.2
SK_AN2: length 8.9
  Top Layer w0.254: U5.1 52.22,11.03 Q1.3
  Top Layer w0.5: Q1.3 52.89,10.35 R7.1
SKEN1: length 21.6
  Top Layer w0.254: U4.29 12.85,26.27 v1(13.21,25.91) ; U7.12 31.82,25.91 v1(31.5,25.91)
  Bottom Layer w0.254: v1(13.21,25.91) v1(31.5,25.91)
SWPW1: length 9.1
  Top Layer w0.254: U7.7 U7.8
  Top Layer w0.5: 34.51,24.51 34.52,24.51 36.7,24.51 37.97,25.77 37.97,26.78 40.89,26.78 C22.2
TXD: length 3.8
  Top Layer w0.254: 3.17,30.35 6.23,30.35 R6.2
VOUT2: length 32.7
  Top Layer w0.254: C24.1 36.11,20.3 U7.4
  Top Layer w0.5: 37.95,18.48 C24.1 ; 37.95,18.48 43.24,18.48 43.81,19.05 43.81,22.25 R14.1 ; 37.95,18.48 37.95,14.83 37.21,14.1 31.12,14.1 29.48,15.73 R8.2 28.76,15.78 C26.2
$1N2976: length 9.5
  Top Layer w0.254: C5.2 23.23,27.3 Y1.2 21.1,29.42 17.3,29.42
$1N2977: length 9.5
  Top Layer w0.254: C7.2 23.29,32.2 Y1.1 21.02,29.92 17.3,29.92
$1N6546: length 13.2
  Top Layer w0.254: U7.6 38.95,23.71 40.77,25.53 42.42,25.53 42.93,26.03 42.93,28.07 42.31,28.69 C22.1
$1N6755: length 8.9
  Top Layer w0.254: U7.5 36.39,23.21 C24.2 C25.1
$1N6889: length 17.3
  Top Layer w0.254: U7.14 30.52,24.21 29.72,25.02 26.54,25.02 25.78,24.26 25.78,19.09 C26.1 27.36,15.78 R8.1 R9.2
$1N7063: length 5.2
  Top Layer w0.254: U7.16 30.14,23.21 C27.2 28.81,21.77 R10.2
$1N7288: length 9.8
  Top Layer w0.254: U7.2 32.86,18.62 C28.2 34.26,17.51 D1.1
$1N7411: length 3.9
  Top Layer w0.5: U6.1 66.94,13.9 R11.1 R12.2
$1N8900: length 8.5
  Top Layer w0.254: R15.1 32.64,47.64 32.64,45.18 R16.2 35.86,41.96 U8.9
$1N8946: length 10.9
  Top Layer w0.254: R16.1 33.52,45.97 v1(34.54,45.97) ; U8.5 v1(38.35,38.77)
  Bottom Layer w0.254: v1(34.54,45.97) 34.54,42.58 v1(38.35,38.77)
$1N9017: length 8
  Top Layer w0.254: 33.02,43.18 30.78,40.94 R23.1 ; 33.02,43.18 31.91,44.29 ; 33.02,43.18 33.77,43.18 U8.10 ; 31.86,44.33 R17.2
$1N9213: length 4.7
  Top Layer w0.254: v1(37.08,42.55) 36.86,42.32 U8.7 ; Q2.4 v1(38.74,41.08)
  Bottom Layer w0.254: v1(38.74,41.08) 37.26,42.55 v1(37.08,42.55)
$1N9419: length 4.2
  Top Layer w0.254: U8.2 35.86,36.63 R19.1 R20.2
$1N9497: length 3.2
  Top Layer w0.254: U8.8 36.36,44.31 C30.2
$1N9569: length 2.9
  Top Layer w0.254: U8.3 36.36,37.33 C31.2
$1N9658: length 6.5
  Top Layer w0.254: C33.2 32.18,36.26 R21.2 33.26,37.34 35.05,37.34 35.36,37.64 U8.1
$1N9684: length 1.8
  Top Layer w0.254: R21.1 32.29,33.27 C32.2
$1N9747: length 3.8
  Top Layer w0.254: R22.2 38.05,37.34 37.21,37.34 36.86,37.69 U8.4
$1N9911: length 20.8
  Top Layer w0.5: U9.7 v1(60.39,37.97) ; U9.5 57.89,52.47 v1(57.91,52.45)
  Bottom Layer w0.5: v1(60.39,37.97) 60.39,49.97 v1(57.91,52.45)
$1N10070: length 1.7
  Top Layer w0.254: R24.1 35.73,34.72 R19.2
$1N10096: length 1.7
  Top Layer w0.254: R25.1 R24.2
$1N11853: length 2.1
  Top Layer w0.5: LED1.1 10.43,50.56 R26.2
$1N11879: length 2.1
  Top Layer w0.5: R27.2 10.41,52.33 LED2.1
$1N11907: length 2.9
  Top Layer w0.5: R26.1 12.17,50.79 U10.7
$1N11914: length 2.9
  Top Layer w0.5: U10.6 12.2,52.06 R27.1
$1N11976: length 2.8
  Top Layer w0.5: U10.2 22.88,50.79 R28.2
$1N12461: length 5.1
  Top Layer w0.254: U4.21 9.18,31.92 9.02,31.75 7.63,31.75 R29.1
$1N12467: length 3.3
  Top Layer w0.254: U4.22 9.57,31.42 9.02,30.86 R6.1

## Copper pours and planes (outline as drawn; the poured copper is in the pictures)
+5V on Inner2: 0.26,79.74 74.74,79.74 74.74,0.26 0.26,0.26
GND on Top Layer: 0,80 75,80 75,0 0,0
GND on Bottom Layer: 0,80 75,80 75,0 0,0
VCC on Top Layer: 27.31,56.01 32.25,56.01 32.25,47.38 27.31,47.38
VCC on Top Layer: 55.53,38.1 58.93,38.1 58.93,32.39 55.53,32.39
VCC on Top Layer: 33.27,29.97 39.5,29.97 39.5,28.32 33.27,28.32
VCC on Inner1: 0.26,79.74 74.74,79.74 74.74,0.26 0.26,0.26

Small or netless copper shapes (teardrops, artwork), in the pictures only: 16 on Inner1, 4 on Inner2

## Text on the board
Top Silkscreen Layer: Y25W21 / Design / By YiLg | Shock / Measurement / EVT_Rev_A
